# Altium schematic sheet SIM Socket.SchDoc: SIM Tray
size 292 x 193 mm; SheetNumber: 12; SheetTotal: 15
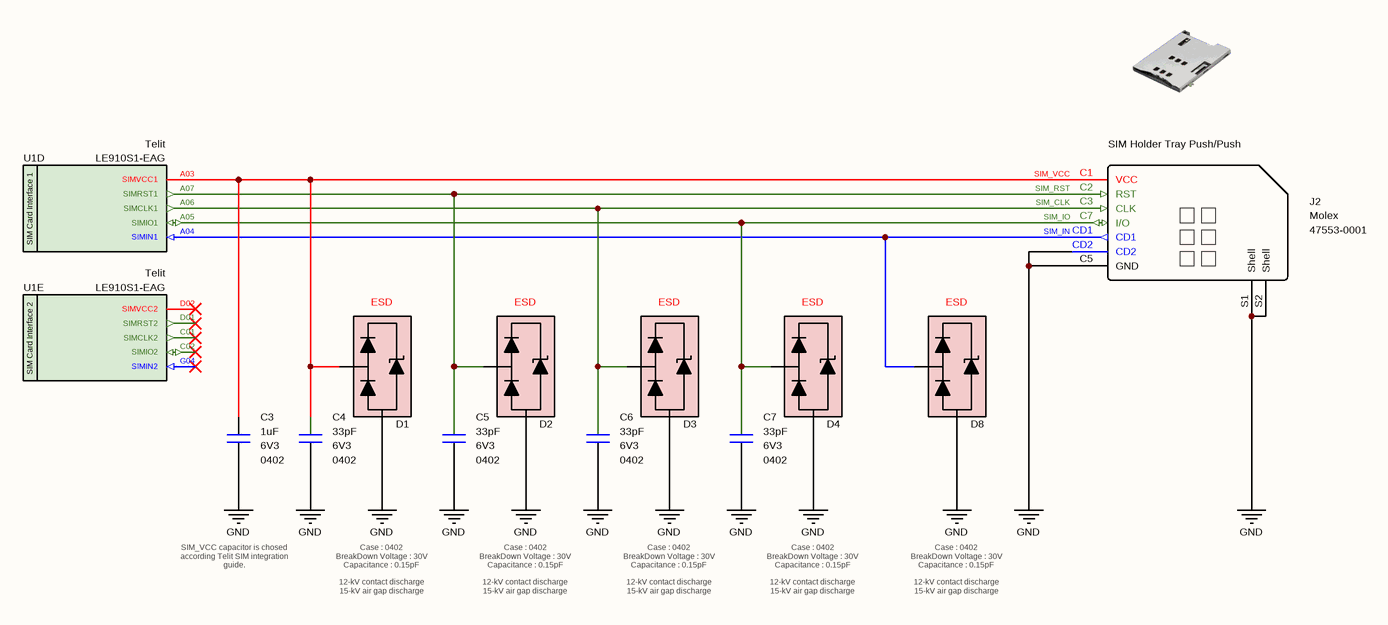
[diagram p0: SIM Socket.SchDoc]

## Parts
C3  value 1uF  Case: 0402  Voltage: 6V3  [Capacitor 0402]
C4  value 33pF  Case: 0402  Voltage: 6V3  [CAPACITOR_0402]
C5  value 33pF  Case: 0402  Voltage: 6V3  [CAPACITOR_0402]
C6  value 33pF  Case: 0402  Voltage: 6V3  [CAPACITOR_0402]
C7  value 33pF  Case: 0402  Voltage: 6V3  [CAPACITOR_0402]
D1  0402ESDA-MLP1  [ESD_0402]  (value not drawn)
D2  0402ESDA-MLP1  [ESD_0402]  (value not drawn)
D3  0402ESDA-MLP1  [ESD_0402]  (value not drawn)
D4  0402ESDA-MLP1  [ESD_0402]  (value not drawn)
D8  0402ESDA-MLP1  [ESD_0402]  (value not drawn)
J2  Card Type: SIM Holder Tray Push/Push  Manufacturer Name: Molex  Manufacturer Part Number: 47553-0001  [Connector - SIM Tray]
U1  Manufacturer Part Number: LE910S1-EAG  Manufacturer Name: Telit  [LE910 GSM Modem]  (hidden comment: LE910S1-EAG LTE GSM Module)  (parts D,E of 19)

## Nets
GND: C3.1 C4.1 C5.1 C6.1 C7.1 D1.2(GND) D2.2(GND) D3.2(GND) D4.2(GND) D8.2(GND) J2.C5(GND) J2.CD2 J2.S1(Shell) J2.S2(Shell)
SIM_CLK: C6.2 D3.1(I/O) J2.C3(CLK) U1.A06(SIMCLK1)
SIM_IN: D8.1(I/O) J2.CD1 U1.A04(SIMIN1)
SIM_IO: C7.2 D4.1(I/O) J2.C7(I/O) U1.A05(SIMIO1)
SIM_RST: C5.2 D2.1(I/O) J2.C2(RST) U1.A07(SIMRST1)
SIM_VCC: C3.2 C4.2 D1.1(I/O) J2.C1(VCC) U1.A03(SIMVCC1)

Not connected (* = marked no-connect by the designer): U1 C01(SIMCLK2)* C02(SIMIO2)* D01(SIMRST2)* D02(SIMVCC2)* G04(SIMIN2)*

## Notes on the sheet
- SIM_VCC capacitor is chosed according Telit SIM integration guide.
- Case : 0402
  BreakDown Voltage : 30V
  Capacitance : 0.15pF
  12-kV contact discharge
  15-kV air gap discharge
- © 2021 All rights reserved.
  This document may not, in whole or in part, be copied, photocopied, reproduced, translated or converted to any electronic or machine readable from without prior written permission of Mehmet Günce Akkoyun.
  Engineer contact : akkoyun@me.com
- Property of
- Engineer :
- Date :
- Size :
- A4
- Time :
- Project :
- Page :
- /
- Customer :
- Product ID :
- Module ID :
- Version :
- File :
- Revision :
- (in symbol Diode - TPD1E05U06DPYR) ESD
- (in symbol IC - LE910S1-EAG, part D) SIM Card Interface 1
- (in symbol IC - LE910S1-EAG, part E) SIM Card Interface 2

## Library data of the parts
C3 = 1uF [0402-6V3]: Multilayer Ceramic Capacitors - SMD - 6.3V 1uF X5R 0402 20%; Manufacturer Part Number: GRM153R60J105ME95D; Manufacturer Name: Murata; Dielectric: X5R; Product Type: Multilayer Ceramic Capacitors; Tolerance: 20%; Minimum Operating Temperature: - 55 C; Width: 0.5mm; Maximum Operating Temperature: + 85 C; Length: 1mm; Height: 0.3mm
C4-C7 = 33pF [0402-6V3]: Capacitor - 33pF [0402] (Ceramic); Manufacturer Part Number: C0402C330J9RACAUTO; Manufacturer Name: Kemet; Dielectric: X7R; Tolerance: 10%; Height: 0.5mm; Maximum Operating Temperature: +125; Minimum Operating Temperature: -55; ROHS: Yes; ComponentLink1Description: DataSheet; ComponentLink1URL: https://api.kemet.com/component-edge/download/datasheet/C0402C330J9RACAUTO.pdf; ComponentLink2Description: Mouser; ComponentLink2URL: https://www.mouser.com/Search/Refine.aspx?Keyword=80-C0402C330J9RAUTO
D1-D4 D8 = Diode - TPD1E05U06DPYR: SUPPRESSOR ESD 30VDC 0402 HFREE; Manufacturer Name: Eaton; Breakdown Voltage: 30V; Capacitance: 0.15pF; Manufacturer Part Number: 0402ESDA-MLP1; Case: 0402
J2 = Sim Holder: Memory Card Connectors ASSY 1.90 SIM CARD R IM CARD READER CONN.
U1 = IC - LE910S1-EAG: Telit LE910S1-EAG GPRS/GNSS Module; Case: BGA